# EAGLE schematic pwm (EAGLE 7.1.0)
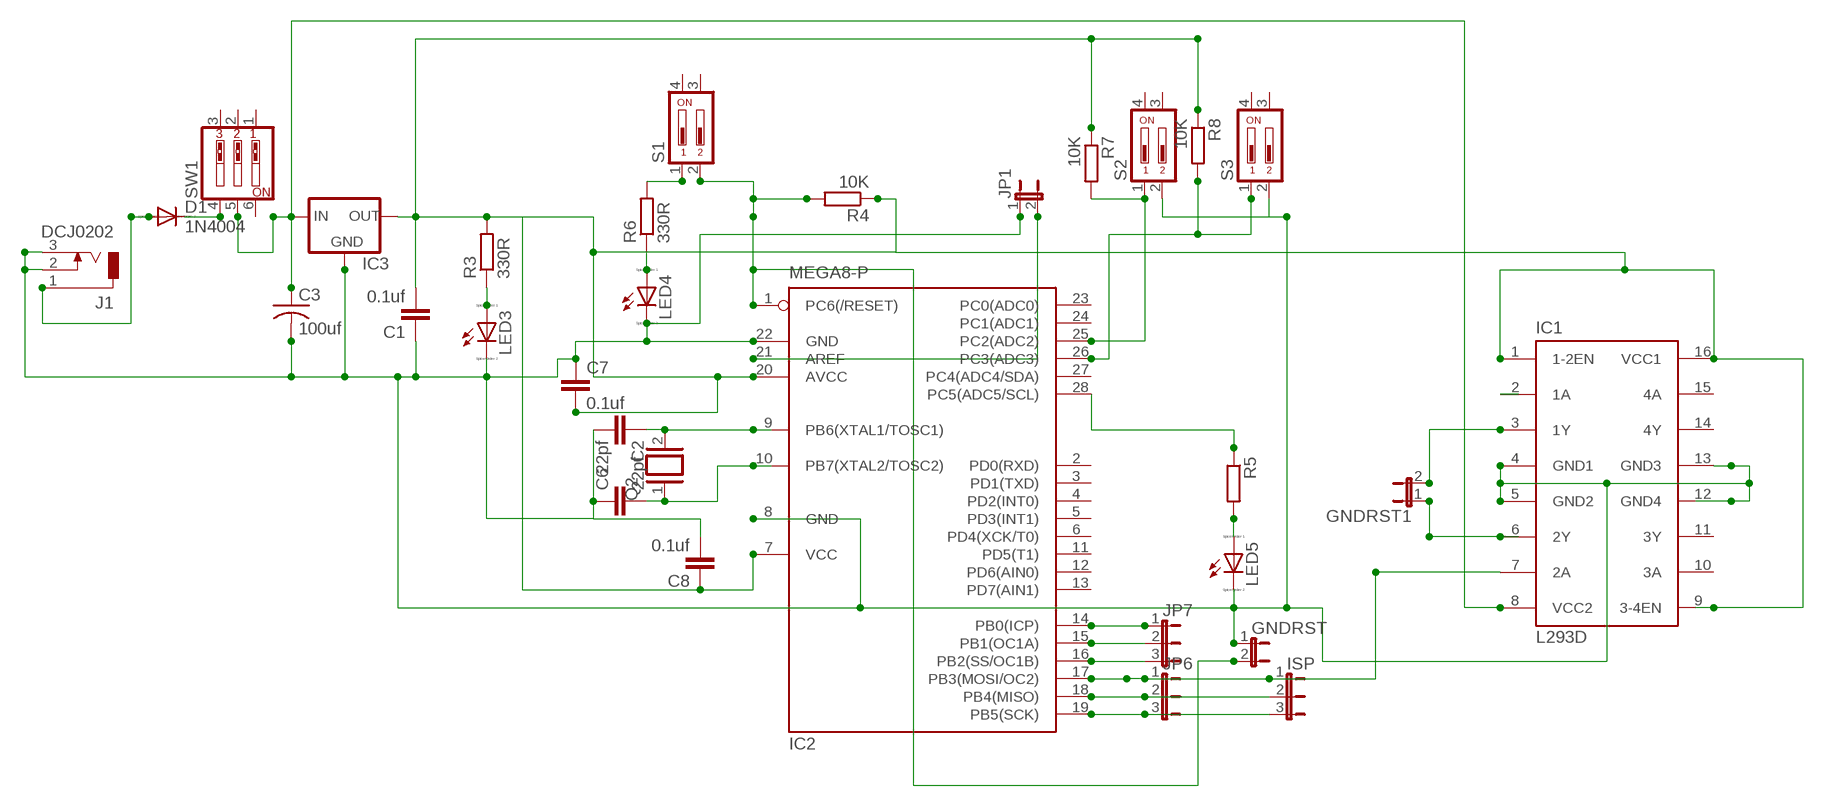
[diagram p0: schematic, sheet 1]

## Parts
C1  0.1uf  C2,5-3  [C2.5-3]
C2  22pf  C2,5-3  [C2.5-3]
C3  100uf  C-US025-025X050  [C025-025X050]
C6  22pf  C2,5-3  [C2.5-3]
C7  0.1uf  C2,5-3  [C2.5-3]
C8  0.1uf  C2,5-3  [C2.5-3]
D1  1N4004  [DO41-10]
GNDRST  JP1E  [JP1]
GNDRST1  JP1E  [JP1]
IC1  L293D  [DIL16]
IC2  MEGA8-P  [DIL28-3]
IC3  78XXS  [78XXS]
ISP  JP2W  [JP2W]
J1  DCJ0202  [DCJ0202]
JP1  JP1E  [JP1]
JP6  JP2W  [JP2W]
JP7  JP2W  [JP2W]
LED3  LED_ELD260  [LED_LD260]
LED4  LED_ELD260  [LED_LD260]
LED5  LED_ELD260  [LED_LD260]
Q2  XTAL/S  [QS]
R3  330R  R-EU_0207/7  [0207/7]
R4  10K  R-EU_0207/7  [0207/7]
R5  R-EU_0207/7  [0207/7]
R6  330R  R-EU_0207/7  [0207/7]
R7  10K  R-EU_0207/7  [0207/7]
R8  10K  R-EU_0207/7  [0207/7]
S1  SD4-02  [SD4-02]
S2  SD4-02  [SD4-02]
S3  SD4-02  [SD4-02]
SW1  SW_DIP-3  [EDG-03]

## Nets
N$1: C3.1 IC1.8(VCC2) IC3.IN SW1.5
N$3: D1.A J1.1
N$4: IC1.2(1A)
N$5: GNDRST1.2 IC1.3(1Y)
N$6: GNDRST1.1 IC1.6(2Y)
N$10: C1.1 C2.2 C3.2 C6.1 C7.1 C8.2 GNDRST.1 IC1.4(GND1) IC1.5(GND2) IC1.13(GND3) IC2.8(GND) IC2.22(GND) IC3.GND J1.2 J1.3 JP1.1 LED3.K(C) LED4.K(C) LED5.K(C) S2.2 S3.2
N$15: D1.C SW1.4
N$17: LED3.A R3.1
N$19: C2.1 IC2.9(PB6(XTAL1/TOSC1)) Q2.2
N$20: C6.2 IC2.10(PB7(XTAL2/TOSC2)) Q2.1
N$21: C1.2 C7.2 C8.1 IC1.1(1-2EN) IC1.9(3-4EN) IC1.16(VCC1) IC2.7(VCC) IC2.20(AVCC) IC3.OUT R3.2 R4.1 R7.1 R8.1
N$22: LED4.A R6.1
N$25: IC2.25(PC2(ADC2)) R7.2 S2.1
N$26: IC2.26(PC3(ADC3)) R8.2 S3.1
N$28: IC2.28(PC5(ADC5/SCL)) R5.1
N$34: IC2.14(PB0(ICP)) JP7.1
N$35: IC2.15(PB1(OC1A)) JP7.2
N$36: IC2.16(PB2(SS/OC1B)) JP7.3
N$37: IC1.7(2A) IC2.17(PB3(MOSI/OC2)) ISP.1 JP6.1
N$38: IC2.18(PB4(MISO)) ISP.2 JP6.2
N$39: IC2.19(PB5(SCK)) ISP.3 JP6.3
N$40: LED5.A R5.2
N$41: R6.2 S1.1
N$42: GNDRST.2 IC2.1(PC6(/RESET)) R4.2 S1.2
N$46: IC2.21(AREF) JP1.2
Unconnected: IC1.10(3A) IC1.11(3Y) IC1.14(4Y) IC1.15(4A) IC2.2(PD0(RXD)) IC2.3(PD1(TXD)) IC2.4(PD2(INT0)) IC2.5(PD3(INT1)) IC2.6(PD4(XCK/T0)) IC2.11(PD5(T1)) IC2.12(PD6(AIN0)) IC2.13(PD7(AIN1)) IC2.23(PC0(ADC0)) IC2.24(PC1(ADC1)) IC2.27(PC4(ADC4/SDA)) S1.3 S1.4 S2.3 S2.4 S3.3 S3.4 SW1.1 SW1.2 SW1.3 SW1.6

## Power pins joined to a net without a drawn wire
GND4: IC1.12(GND4)

## Library data of the parts
C1 C2 C6-C8 = capacitor-wima:C: CAPACITOR naming: grid - package width
C3 = resistor:C-US: CAPACITOR, American symbol
D1 = diode:1N4004: DIODE general purpose rectifier, 1 A
GNDRST GNDRST1 JP1 = jumper:JP1E: JUMPER
IC1 = st-microelectronics:L293D: PUSH-PULL 4 CHANNEL DRIVER; MPN: L293D; OC_FARNELL: 9589619; OC_NEWARK: 56P8249
IC2 = atmel:MEGA8-P: MICROCONTROLLER 8 Kbytes FLASH, 1 kbytes SRAM, 512 bytes EEPROM, USART, 4-channel 10 bit ADC, 2-channel 8 bit ADC Pin compatible with Atmega48, ATMega88, ATMega168 Source: avr.lbr; OC_FARNELL: unknown; OC_NEWARK: unknown
IC3 = v-reg:78XXS: VOLTAGE REGULATOR
ISP JP6 JP7 = jumper:JP2W: JUMPER
J1 = con-jack:DCJ0202: DC POWER JACK Source: DCJ0202.pdf; OC_FARNELL: unknown; OC_NEWARK: unknown
LED3-LED5 = eagle-ltspice:LED_E: LED Source: http://www.osram.convergy.de Source: www.luxeon.com Source: www.kingbright.com; SPICEMODEL: NONE; SPICEPREFIX: D; SPICETYPE: diode
Q2 = special:XTAL/S: CRYSTAL
R3-R8 = rcl:R-EU_: RESISTOR, European symbol
S1-S3 = switch-dil:SD4-02: DIL/CODE SWITCH; OC_FARNELL: unknown; OC_NEWARK: unknown
SW1 = special:SW_DIP-3: DIP SWITCH